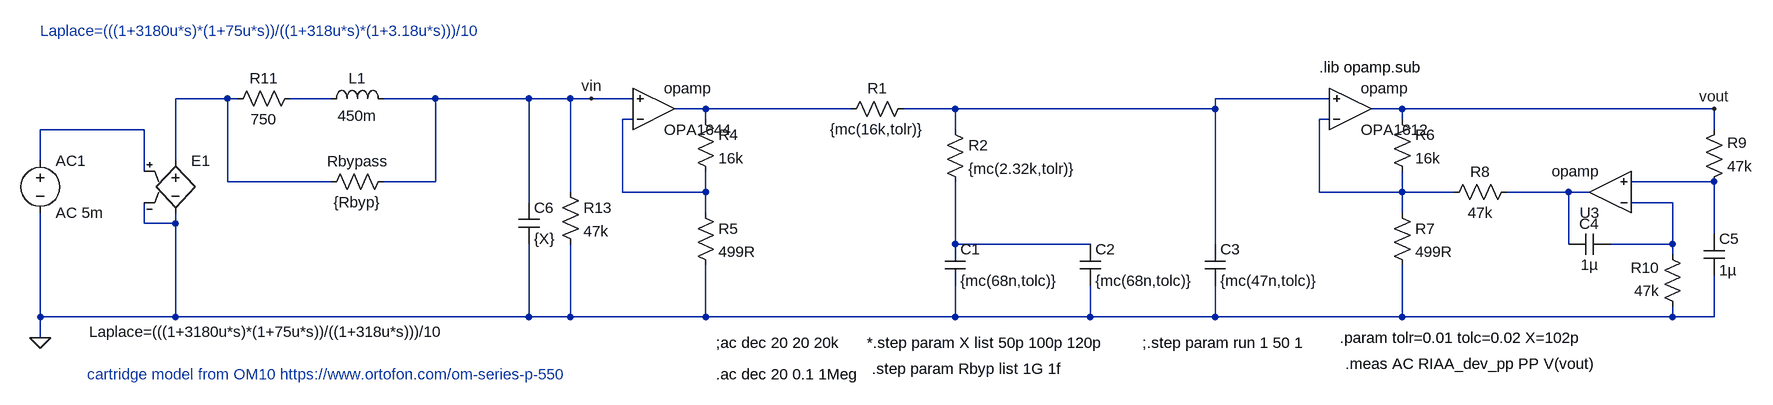
[diagram p0: schematic RIAA_Filter.asc]
RIAA_Filter.asc, the LTspice schematic file:
Version 4
SHEET 1 1920 680
WIRE -912 64 -992 64
WIRE -896 64 -912 64
WIRE -752 64 -816 64
WIRE -592 64 -672 64
WIRE -448 64 -592 64
WIRE -384 64 -448 64
WIRE -352 64 -384 64
WIRE -288 64 -352 64
WIRE 784 64 608 64
WIRE -176 80 -224 80
WIRE 48 80 -176 80
WIRE 208 80 128 80
WIRE 608 80 608 64
WIRE 608 80 208 80
WIRE 896 80 848 80
WIRE 1376 80 896 80
WIRE -288 96 -304 96
WIRE -176 96 -176 80
WIRE 784 96 768 96
WIRE 896 96 896 80
WIRE -1040 112 -1200 112
WIRE 208 112 208 80
WIRE 1376 112 1376 80
WIRE -1200 160 -1200 112
WIRE -992 160 -992 64
WIRE -1040 176 -1040 112
WIRE -912 192 -912 64
WIRE -752 192 -912 192
WIRE -592 192 -592 64
WIRE -592 192 -672 192
WIRE 1376 192 1248 192
WIRE -384 208 -384 64
WIRE -304 208 -304 96
WIRE -176 208 -176 176
WIRE -176 208 -304 208
WIRE 768 208 768 96
WIRE 896 208 896 176
WIRE 896 208 768 208
WIRE 976 208 896 208
WIRE 1152 208 1056 208
WIRE 1184 208 1152 208
WIRE -448 224 -448 64
WIRE 1312 224 1248 224
WIRE -176 240 -176 208
WIRE 896 240 896 208
WIRE -1040 256 -1040 224
WIRE -992 256 -992 240
WIRE -992 256 -1040 256
WIRE 1376 272 1376 192
WIRE 208 288 208 192
WIRE 416 288 208 288
WIRE 608 288 608 80
WIRE 1152 288 1152 208
WIRE 1312 288 1312 224
WIRE 1312 288 1216 288
WIRE 1312 304 1312 288
WIRE -1200 400 -1200 240
WIRE -992 400 -992 256
WIRE -992 400 -1200 400
WIRE -448 400 -448 288
WIRE -448 400 -992 400
WIRE -384 400 -384 288
WIRE -384 400 -448 400
WIRE -176 400 -176 320
WIRE -176 400 -384 400
WIRE 208 400 208 352
WIRE 208 400 -176 400
WIRE 416 400 416 352
WIRE 416 400 208 400
WIRE 608 400 608 352
WIRE 608 400 416 400
WIRE 896 400 896 320
WIRE 896 400 608 400
WIRE 1312 400 1312 384
WIRE 1312 400 896 400
WIRE 1376 400 1376 336
WIRE 1376 400 1312 400
WIRE -1200 432 -1200 400
FLAG -1200 432 0
FLAG 1376 80 vout
FLAG -352 64 vin
SYMBOL voltage -1200 144 R0
WINDOW 123 0 0 Left 0
WINDOW 39 0 0 Left 0
SYMATTR InstName AC1
SYMATTR Value AC 5m
SYMBOL res 144 64 R90
WINDOW 0 0 56 VBottom 2
WINDOW 3 32 56 VTop 2
SYMATTR InstName R1
SYMATTR Value {mc(16k,tolr)}
SYMBOL res 192 96 R0
SYMATTR InstName R2
SYMATTR Value {mc(2.32k,tolr)}
SYMBOL cap 192 288 R0
SYMATTR InstName C1
SYMATTR Value {mc(68n,tolc)}
SYMBOL cap 400 288 R0
SYMATTR InstName C2
SYMATTR Value {mc(68n,tolc)}
SYMBOL cap 592 288 R0
SYMATTR InstName C3
SYMATTR Value {mc(47n,tolc)}
SYMBOL e -992 144 R0
WINDOW 3 -133 279 Left 2
SYMATTR Value Laplace=(((1+3180u*s)*(1+75u*s))/((1+318u*s)))/10
SYMATTR InstName E1
SYMBOL OpAmps\\opamp -256 144 M180
SYMATTR InstName OPA1644
SYMATTR SpiceLine Aol=1Meg
SYMATTR SpiceLine2 GBW=11Meg
SYMBOL res -192 80 R0
SYMATTR InstName R4
SYMATTR Value 16k
SYMBOL res -192 224 R0
SYMATTR InstName R5
SYMATTR Value 499R
SYMBOL OpAmps\\opamp 816 144 M180
SYMATTR InstName OPA1612
SYMATTR SpiceLine Aol=1Meg
SYMATTR SpiceLine2 GBW=40Meg
SYMBOL res 880 80 R0
SYMATTR InstName R6
SYMATTR Value 16k
SYMBOL res 880 224 R0
SYMATTR InstName R7
SYMATTR Value 499R
SYMBOL OpAmps\\opamp 1216 272 R180
SYMATTR InstName U3
SYMBOL res 1072 192 R90
WINDOW 0 0 56 VBottom 2
WINDOW 3 32 56 VTop 2
SYMATTR InstName R8
SYMATTR Value 47k
SYMBOL res 1360 208 M180
WINDOW 0 36 76 Left 2
WINDOW 3 36 40 Left 2
SYMATTR InstName R9
SYMATTR Value 47k
SYMBOL res 1328 400 R180
WINDOW 0 36 76 Left 2
WINDOW 3 36 40 Left 2
SYMATTR InstName R10
SYMATTR Value 47k
SYMBOL cap 1216 272 R90
WINDOW 0 0 32 VBottom 2
WINDOW 3 32 32 VTop 2
SYMATTR InstName C4
SYMATTR Value 1µ
SYMBOL cap 1360 336 M180
WINDOW 0 24 56 Left 2
WINDOW 3 24 8 Left 2
SYMATTR InstName C5
SYMATTR Value 1µ
SYMBOL res -800 48 R90
WINDOW 0 0 56 VBottom 2
WINDOW 3 32 56 VTop 2
SYMATTR InstName R11
SYMATTR Value 750
SYMBOL ind -768 80 R270
WINDOW 0 32 56 VTop 2
WINDOW 3 5 56 VBottom 2
SYMATTR InstName L1
SYMATTR Value 450m
SYMBOL res -400 192 R0
SYMATTR InstName R13
SYMATTR Value 47k
SYMBOL cap -464 224 R0
SYMATTR InstName C6
SYMATTR Value {X}
SYMBOL res -656 176 R90
WINDOW 0 0 56 VBottom 2
WINDOW 3 32 56 VTop 2
SYMATTR InstName Rbypass
SYMATTR Value {Rbyp}
TEXT -160 488 Left 2 !.ac dec 20 0.1 1Meg
TEXT 496 440 Left 2 !;.step param run 1 50 1
TEXT 800 432 Left 2 !.param tolr=0.01 tolc=0.02 X=102p
TEXT -1200 -40 Left 2 ;Laplace=(((1+3180u*s)*(1+75u*s))/((1+318u*s)*(1+3.18u*s)))/10
TEXT 768 16 Left 2 !.lib opamp.sub
TEXT 72 440 Left 2 !*.step param X list 50p 100p 120p
TEXT -1128 488 Left 2 ;cartridge model from OM10 https://www.ortofon.com/om-series-p-550
TEXT -160 440 Left 2 !;ac dec 20 20 20k
TEXT 808 472 Left 2 !.meas AC RIAA_dev_pp PP V(vout)
TEXT 80 480 Left 2 !.step param Rbyp list 1G 1f

The netlist it stands for:
* RIAA_Filter.asc
V§AC1 N007 0 AC 5m
R1 N003 N004 {mc(16k,tolr)}
R2 N003 N011 {mc(2.32k,tolr)}
C1 N011 0 {mc(68n,tolc)}
C2 N011 0 {mc(68n,tolc)}
C3 N003 0 {mc(47n,tolc)}
E1 N001 0 N007 0 Laplace=(((1+3180u*s)*(1+75u*s))/((1+318u*s)))/10
XOPA1644 N005 vin N004 opamp Aol=1Meg GBW=11Meg  ; pins invin noninvin out
R4 N004 N005 16k
R5 N005 0 499R
XOPA1612 N006 N003 vout opamp Aol=1Meg GBW=40Meg  ; pins invin noninvin out
R6 vout N006 16k
R7 N006 0 499R
XU3 N010 N008 N009 opamp Aol=100K GBW=10Meg  ; pins invin noninvin out
R8 N009 N006 47k
R9 N008 vout 47k
R10 0 N010 47k
C4 N010 N009 1µ
C5 0 N008 1µ
R11 N002 N001 750
L1 N002 vin 450m
R13 vin 0 47k
C6 vin 0 {X}
Rbypass vin N001 {Rbyp}
.ac dec 20 0.1 1Meg
;.step param run 1 50 1
.param tolr=0.01 tolc=0.02 X=102p
* Laplace=(((1+3180u*s)*(1+75u*s))/((1+318u*s)*(1+3.18u*s)))/10
.lib opamp.sub
*.step param X list 50p 100p 120p
* cartridge model from OM10 https://www.ortofon.com/om-series-p-550
;ac dec 20 20 20k
.meas AC RIAA_dev_pp PP V(vout)
.step param Rbyp list 1G 1f
.backanno
.end